# Altium schematic sheet LoRa_PCB.SchDoc: Наименование
size 420 x 297 mm; ApprovedBy: Утвердил; CheckedBy: Проверил; Author: Разработал; CompanyName: Организация; DrawnBy: Н.Контр; Engineer: Т.Контр; SheetNumber: 1; SheetTotal: 1; PageSetup: Record=PageOptions|CenterHorizontal=True|CenterVertical=True|PrintScale=0.94|XCorrection=1.00|YCorrection=1.00|PrintKind=1|BorderSize=5000000|LeftOffset=0|BottomOffset=0|Orientation=1|PaperLength=1000|PaperWidth=1000|Scale=100|PaperSource=7|PrintQuality=-4|MediaType=1|DitherType=10|PaperKind=A4|PrintScaleMode=1; DecimalNumber: Децимальный номер; HeadOfSector: Нач. сектора; MainDevice: Перв.примен.; Name: Наименование; DocumentName: Sheet1.SCHDOC
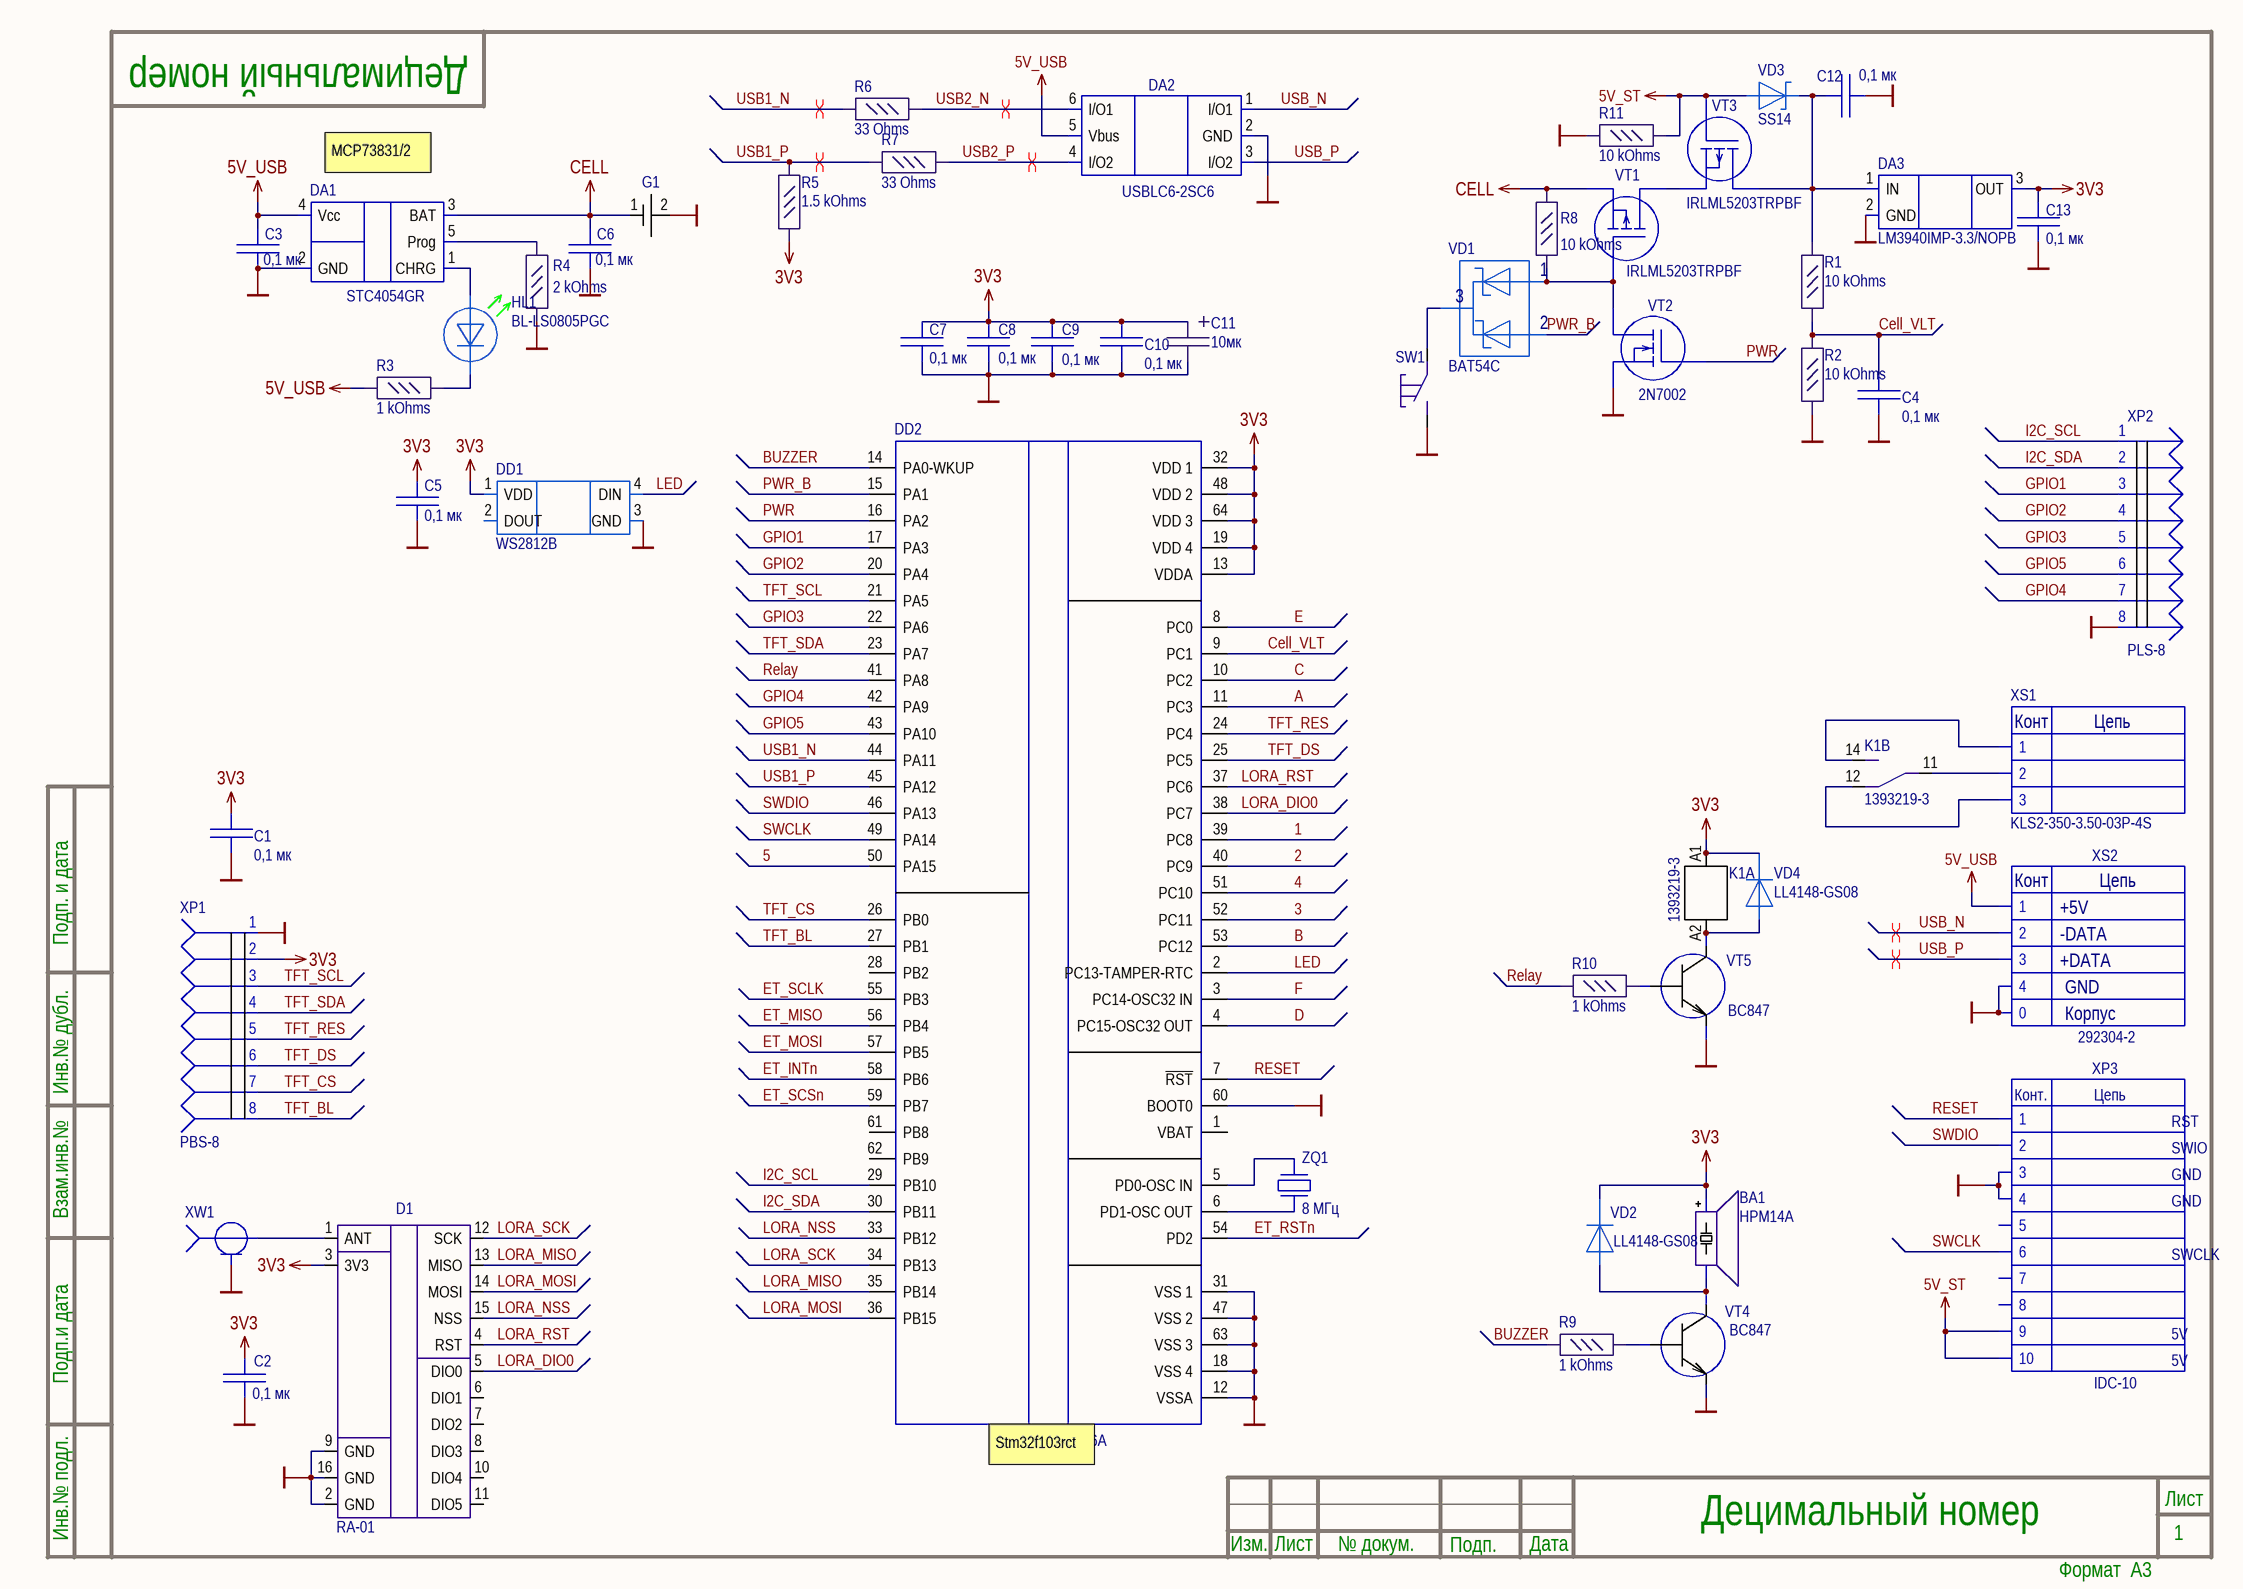
[diagram p0: LoRa_PCB.SchDoc]

## Parts
BA1  HPM14A  [HPM14A]
C1  0,1 мк  [C_0805]
C2  0,1 мк  [C_0805]
C3  0,1 мк  [C_0805]
C4  0,1 мк  [C_0805]
C5  0,1 мк  [C_0805]
C6  0,1 мк  [C_0805]
C7  0,1 мк  [C_0805]
C8  0,1 мк  [C_0805]
C9  0,1 мк  [C_0805]
C10  0,1 мк  [C_0805]
C11  10мк  [D_CASE]
C12  0,1 мк  [C_0805]
C13  0,1 мк  [C_0805]
D1  RA-01  [RA-02]
DA1  STC4054GR  [TSOT23-5L]
DA2  USBLC6-2SC6  [SOT-23-6]
DA3  LM3940IMP-3.3/NOPB  [SOT223]
DD1  WS2812B  [WS2812B]
DD2  STM32F103R6T6A  [LQFP64]
G1  12BHC186P1-GR  [12BHC186P1-GR]  (value not drawn)
HL1  BL-LS0805PGC  [LED_0805_GREEN]
K1  1393219-3  [1393219-3]  (parts A,B of 2)
R1  10 kOhms  [R_0805]
R2  10 kOhms  [R_0805]
R3  1 kOhms  [R_0805]
R4  2 kOhms  [R_0805]
R5  1.5 kOhms  [R_0805]
R6  33 Ohms  [R_0805]
R7  33 Ohms  [R_0805]
R8  10 kOhms  [R_0805]
R9  1 kOhms  [R_0805]
R10  1 kOhms  [R_0805]
R11  10 kOhms  [R_0805]
SW1  KLS7-TS6604  [KLS7-TS6604-5.0-180-B]  (value not drawn)
VD1  BAT54C  [SOT23]
VD2  LL4148-GS08  [SOD-80]
VD3  SS14  [DO-214AC]
VD4  LL4148-GS08  [SOD-80]
VT1  IRLML5203TRPBF  [SOT23]
VT2  2N7002  [SOT23]
VT3  IRLML5203TRPBF  [SOT23]
VT4  BC847  [SOT23]
VT5  BC847  [SOT23]
XP1  PBS-8  [PBS-8]
XP2  PLS-8  [PLS-8]
XP3  IDC-10  [IDC-10]
XS1  KLS2-350-3.50-03P-4S  [KLS2-350-3.50-03P-4S]
XS2  292304-2  [USB-B]
XW1  HYR-1139-RP  [SMA (HYR1139)]  (value not drawn)
ZQ1  8 МГц  [MJ CRYSTAL]

## Nets
3V3: BA1.1 C1.2 C2.2 C5.2 C7.2 C8.2 C9.2 C10.2 C11.1 C13.2 D1.3(3V3) DA3.3(OUT) DD1.1(VDD) DD2.13(VDDA) DD2.19(VDD_4) DD2.32(VDD_1) DD2.48(VDD_2) DD2.64(VDD_3) K1.A1 R5.1 VD2.2 VD4.2 XP1.2
5V_ST: R11.1 VD3.1 VT3.1(G) XP3.9 XP3.10
5V_USB: C3.2 DA1.4(Vcc) DA2.5(Vbus) R3.2 XS2.1
CELL: C6.2 DA1.3(BAT) G1.1 R8.2 VT1.2(S)
GND: C1.1 C2.1 C3.1 C4.1 C5.1 C6.1 C7.1 C8.1 C9.1 C10.1 C11.2 C12.2 C13.1 D1.2(GND) D1.9(GND) D1.16(GND) DA1.2(GND) DA2.2(GND) DA3.2(GND) DD1.3(GND) DD2.12(VSSA) DD2.18(VSS_4) DD2.31(VSS_1) DD2.47(VSS_2) DD2.60(BOOT0) DD2.63(VSS_3) G1.2 R2.2 R4.1 R11.2 SW1.1 VT2.2(S) VT4.2(E) VT5.2(E) XP1.1 XP2.8 XP3.3 XP3.4 XS2.0 XS2.4 XW1.1
1: DD2.39(PC8)
2: DD2.40(PC9)
3: DD2.52(PC11)
4: DD2.51(PC10)
5: DD2.50(PA15)
A: DD2.11(PC3)
B: DD2.53(PC12)
BUZZER: DD2.14(PA0-WKUP) R9.2
C: DD2.10(PC2)
Cell_VLT: C4.2 DD2.9(PC1) R1.2 R2.1
D: DD2.4(PC15-OSC32_OUT)
E: DD2.8(PC0)
ET_INTn: DD2.58(PB6)
ET_MISO: DD2.56(PB4)
ET_MOSI: DD2.57(PB5)
ET_RSTn: DD2.54(PD2)
ET_SCLK: DD2.55(PB3)
ET_SCSn: DD2.59(PB7)
F: DD2.3(PC14-OSC32_IN)
GPIO1: DD2.17(PA3) XP2.3
GPIO2: DD2.20(PA4) XP2.4
GPIO3: DD2.22(PA6) XP2.5
GPIO4: DD2.42(PA9) XP2.7
GPIO5: DD2.43(PA10) XP2.6
I2C_SCL: DD2.29(PB10) XP2.1
I2C_SDA: DD2.30(PB11) XP2.2
LED: DD1.4(DIN) DD2.2(PC13-TAMPER-RTC)
LORA_DIO0: D1.5(DIO0) DD2.38(PC7)
LORA_MISO: D1.13(MISO) DD2.35(PB14)
LORA_MOSI: D1.14(MOSI) DD2.36(PB15)
LORA_NSS: D1.15(NSS) DD2.33(PB12)
LORA_RST: D1.4(RST) DD2.37(PC6)
LORA_SCK: D1.12(SCK) DD2.34(PB13)
PWR: DD2.16(PA2) VT2.1(G)
PWR_B: DD2.15(PA1) VD1.2(C2)
Relay: DD2.41(PA8) R10.2
RESET: DD2.7(~{RST}) XP3.1
SWCLK: DD2.49(PA14) XP3.6
SWDIO: DD2.46(PA13) XP3.2
TFT_BL: DD2.27(PB1) XP1.8
TFT_CS: DD2.26(PB0) XP1.7
TFT_DS: DD2.25(PC5) XP1.6
TFT_RES: DD2.24(PC4) XP1.5
TFT_SCL: DD2.21(PA5) XP1.3
TFT_SDA: DD2.23(PA7) XP1.4
USB1_N: DD2.44(PA11) R6.1
USB1_P: DD2.45(PA12) R5.2 R7.1
USB2_N: DA2.6(I/O1) R6.2
USB2_P: DA2.4(I/O2) R7.2
USB_N: DA2.1(I/O1) XS2.2
USB_P: DA2.3(I/O2) XS2.3
NetBA1_2: BA1.2 VD2.1 VT4.3(C)
NetC12_1: C12.1 DA3.1(IN) R1.1 VD3.2 VT3.3(D)
NetD1_1: D1.1(ANT) XW1.2
NetDA1_1: DA1.1(CHRG) HL1.1
NetDA1_5: DA1.5(Prog) R4.2
NetDD2_5: DD2.5(PD0-OSC_IN) ZQ1.3
NetDD2_6: DD2.6(PD1-OSC_OUT) ZQ1.1
NetHL1_2: HL1.2 R3.1
NetK1_11: K1.11 XS1.2
NetK1_12: K1.12 XS1.3
NetK1_14: K1.14 XS1.1
NetK1_A2: K1.A2 VD4.1 VT5.3(C)
NetR8_1: R8.1 VD1.1(A1) VT1.1(G) VT2.3(D)
NetR9_1: R9.1 VT4.1(B)
NetR10_1: R10.1 VT5.1(B)
NetSW1_2: SW1.2 VD1.3(C1A2)
NetVT1_3: VT1.3(D) VT3.2(S)

Not connected (* = marked no-connect by the designer): D1 6(DIO1) 7(DIO2) 8(DIO3) 10(DIO4) 11(DIO5); DD1 2(DOUT); DD2 1(VBAT) 28(PB2) 61(PB8) 62(PB9); XP3 5 7 8

## Layout directives
differential pair: USB1_N, USB1_P, USB2_N, USB2_P, USB_N, USB_P

## Notes on the sheet
- (near DA1) MCP73831/2
- RST
- SWIO
- GND
- SWCLK
- 5V
- (near DD2) Stm32f103rct
- Подп. и дата
- Инв.№ дубл.
- Взам.инв.№
- Подп.и дата
- Инв.№ подл.
- Изм.
- Лист
- № докум.
- Подп.
- Дата
- Формат  A3
- (in symbol 292304-2) Конт; Цепь; +5V; -DATA; +DATA; GND; Корпус
- (in symbol IDC-10) Конт.; Цепь
- (in symbol KLS2-350-3.50-03P-4S) Конт; Цепь

## Library data of the parts
C1-C10 C12 C13 = C_0805
C11 = T491D106K035AT: CAP TANT 10UF 10% 35V 2917; Manufacturer: KEMET; Value: 10µF; Part Number: T491D106K035AT; ComponentLink1URL: https://api.kemet.com/component-edge/download/datasheet/T491D106K035AT.pdf; ComponentLink1Description: Datasheet; Component Type: Tantalum Capacitor
D1 = RA-01: LoRa modem
DA1 = STC4054GR: Контроллер заряда Lion батарей
DA3 = LM3940IMP-3.3/NOPB: Регулятор с малым падением напряжения, преобразование 5В в 3.3В/ 1А
DD2 = STM32F103R6T6A: 32-Bit 72MHz 32KB (32K x 8) FLASH 64-LQFP
G1 = 12BHC186P1-GR: Батарейный отсек 1x18650
K1 = 1393219-3: Реле 5VDC
R1 R2 R8 R11 = CR0805-FX-1002ELF: RES SMD 10K OHM 1% 1/8W 0805; Manufacturer: Bourns Inc.; Part Number: CR0805-FX-1002ELF; ComponentLink1URL: https://www.bourns.com/docs/product-datasheets/CRxxxxx.pdf; ComponentLink1Description: Datasheet; Component Type: Resistor
R3 R9 R10 = CR0805-FX-1001ELF: RES SMD 1K OHM 1% 1/8W 0805; Manufacturer: Bourns Inc.; Part Number: CR0805-FX-1001ELF; ComponentLink1URL: https://www.bourns.com/docs/product-datasheets/CRxxxxx.pdf; ComponentLink1Description: Datasheet; Component Type: Resistor
R4 = CR0805-FX-2001ELF: RES SMD 2K OHM 1% 1/8W 0805; Manufacturer: Bourns Inc.; Part Number: CR0805-FX-2001ELF; ComponentLink1URL: https://www.bourns.com/docs/product-datasheets/CRxxxxx.pdf; ComponentLink1Description: Datasheet; Component Type: Resistor
R5 = CR0805-FX-1501ELF: RES SMD 1.5K OHM 1% 1/8W 0805; Manufacturer: Bourns Inc.; Part Number: CR0805-FX-1501ELF; ComponentLink1URL: https://www.bourns.com/docs/product-datasheets/CRxxxxx.pdf; ComponentLink1Description: Datasheet; Component Type: Resistor
R6 R7 = CR0805-FX-33R0ELF: RES SMD 33 OHM 1% 1/8W 0805; Manufacturer: Bourns Inc.; Value: 33; Part Number: CR0805-FX-33R0ELF; ComponentLink1URL: https://www.bourns.com/docs/product-datasheets/CRxxxxx.pdf; ComponentLink1Description: Datasheet; Component Type: Resistor
VD1 = BAT54C: Диод Шоттки, 2 диода, общий катод, 30В, 0.2А [SOT-23] /
VD2 VD4 = LL4148-GS08: Диод
VT1 VT3 = IRLML5203TRPBF: Транзистор, P-канал 30В 3A logic
VT2 = 2N7002: N-ch MFE transistor
XS1 = KLS2-350-3.50-03P-4S: Клеммник, 3-контактный, 3.5мм
ZQ1 = NX5032GA-8MHz
BA1 = HPM14A: HelpURL: https://static.chipdip.ru/lib/243/DOC000243438.pdf
DA2 = USBLC6-2SC6: HelpURL: https://static.chipdip.ru/lib/093/DOC001093117.pdf